# Altium schematic sheet Flight_Computer.SchDoc
size Letter
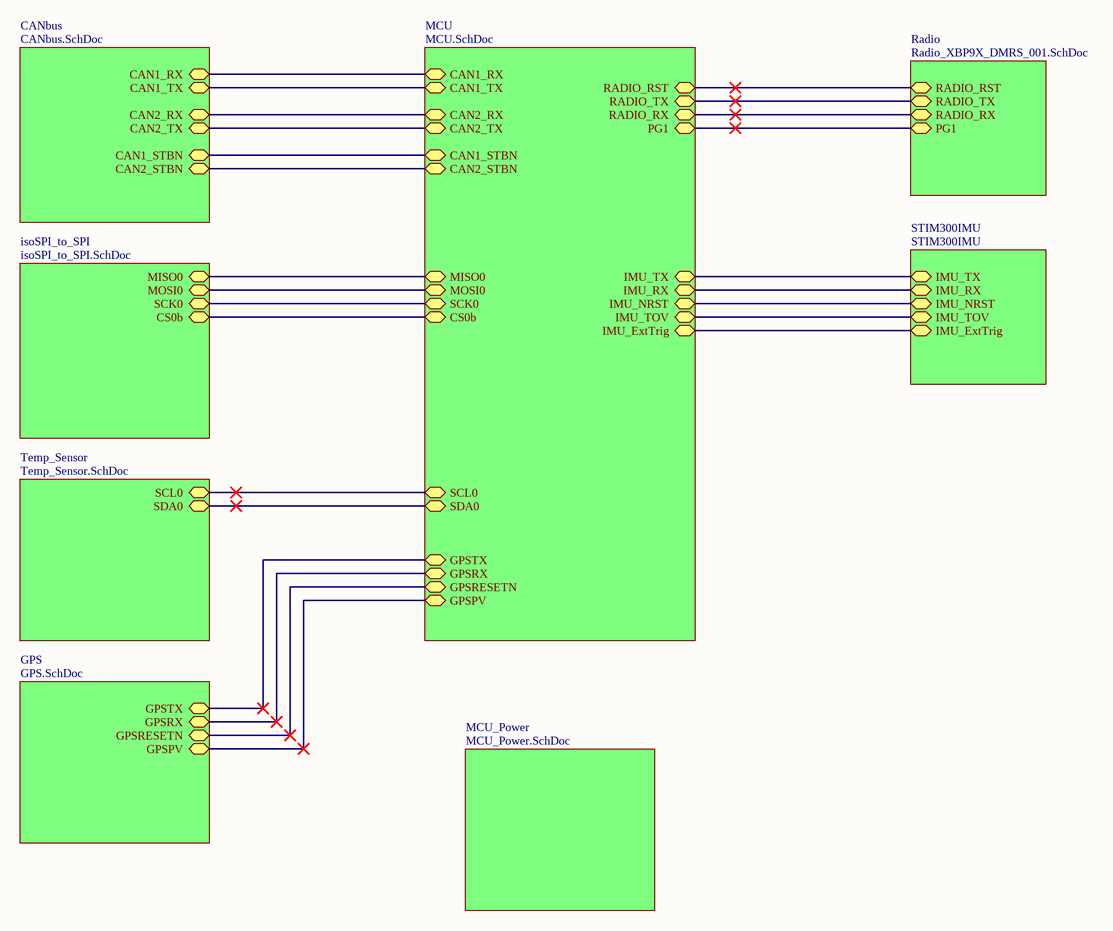
[diagram p0: Flight_Computer.SchDoc]

## Sub-sheets
CANbus = CANbus.SchDoc: CAN1_RX (bidir), CAN1_TX (bidir), CAN2_RX (bidir), CAN2_TX (bidir), CAN1_STBN (bidir), CAN2_STBN (bidir)
GPS = GPS.SchDoc: GPSTX (bidir), GPSRX (bidir), GPSRESETN (bidir), GPSPV (bidir)
isoSPI_to_SPI = isoSPI_to_SPI.SchDoc: MISO0 (bidir), MOSI0 (bidir), SCK0 (bidir), CS0b (bidir)
MCU = MCU.SchDoc: CAN1_RX (bidir), CAN1_TX (bidir), CAN2_RX (bidir), CAN2_TX (bidir), MISO0 (bidir), MOSI0 (bidir), SCK0 (bidir), CS0b (bidir), SCL0 (bidir), SDA0 (bidir), CAN1_STBN (bidir), CAN2_STBN (bidir), RADIO_TX (bidir), RADIO_RX (bidir), IMU_TX (bidir), IMU_RX (bidir), IMU_NRST (bidir), IMU_TOV (bidir), IMU_ExtTrig (bidir), GPSTX (bidir), GPSRX (bidir), GPSRESETN (bidir), GPSPV (bidir), PG1 (bidir), RADIO_RST (bidir)
MCU_Power = MCU_Power.SchDoc: no entries
Radio = Radio_XBP9X_DMRS_001.SchDoc: RADIO_RX (bidir), RADIO_TX (bidir), PG1 (bidir), RADIO_RST (bidir)
STIM300IMU = STIM300IMU: IMU_TX (bidir), IMU_RX (bidir), IMU_NRST (bidir), IMU_TOV (bidir), IMU_ExtTrig (bidir)
Temp_Sensor = Temp_Sensor.SchDoc: SCL0 (bidir), SDA0 (bidir)

## Nets
(unnamed): sheet MCU/CAN1_RX, sheet CANbus/CAN1_RX
(unnamed): sheet MCU/CAN1_TX, sheet CANbus/CAN1_TX
(unnamed): sheet MCU/CAN2_RX, sheet CANbus/CAN2_RX
(unnamed): sheet MCU/CAN2_TX, sheet CANbus/CAN2_TX
(unnamed): sheet MCU/MISO0, sheet isoSPI_to_SPI/MISO0
(unnamed): sheet MCU/MOSI0, sheet isoSPI_to_SPI/MOSI0
(unnamed): sheet MCU/SCK0, sheet isoSPI_to_SPI/SCK0
(unnamed): sheet MCU/CS0b, sheet isoSPI_to_SPI/CS0b
(unnamed): sheet MCU/SCL0, sheet Temp_Sensor/SCL0
(unnamed): sheet MCU/SDA0, sheet Temp_Sensor/SDA0
(unnamed): sheet MCU/CAN1_STBN, sheet CANbus/CAN1_STBN
(unnamed): sheet MCU/CAN2_STBN, sheet CANbus/CAN2_STBN
(unnamed): sheet MCU/RADIO_TX, sheet Radio/RADIO_TX
(unnamed): sheet MCU/RADIO_RX, sheet Radio/RADIO_RX
(unnamed): sheet MCU/IMU_TX, sheet STIM300IMU/IMU_TX
(unnamed): sheet MCU/IMU_RX, sheet STIM300IMU/IMU_RX
(unnamed): sheet MCU/IMU_NRST, sheet STIM300IMU/IMU_NRST
(unnamed): sheet MCU/IMU_TOV, sheet STIM300IMU/IMU_TOV
(unnamed): sheet MCU/IMU_ExtTrig, sheet STIM300IMU/IMU_ExtTrig
(unnamed): sheet MCU/GPSTX, sheet GPS/GPSTX
(unnamed): sheet MCU/GPSRX, sheet GPS/GPSRX
(unnamed): sheet MCU/GPSRESETN, sheet GPS/GPSRESETN
(unnamed): sheet MCU/GPSPV, sheet GPS/GPSPV
(unnamed): sheet MCU/PG1, sheet Radio/PG1
(unnamed): sheet MCU/RADIO_RST, sheet Radio/RADIO_RST